# EAGLE schematic swarm (EAGLE 9.1.3)
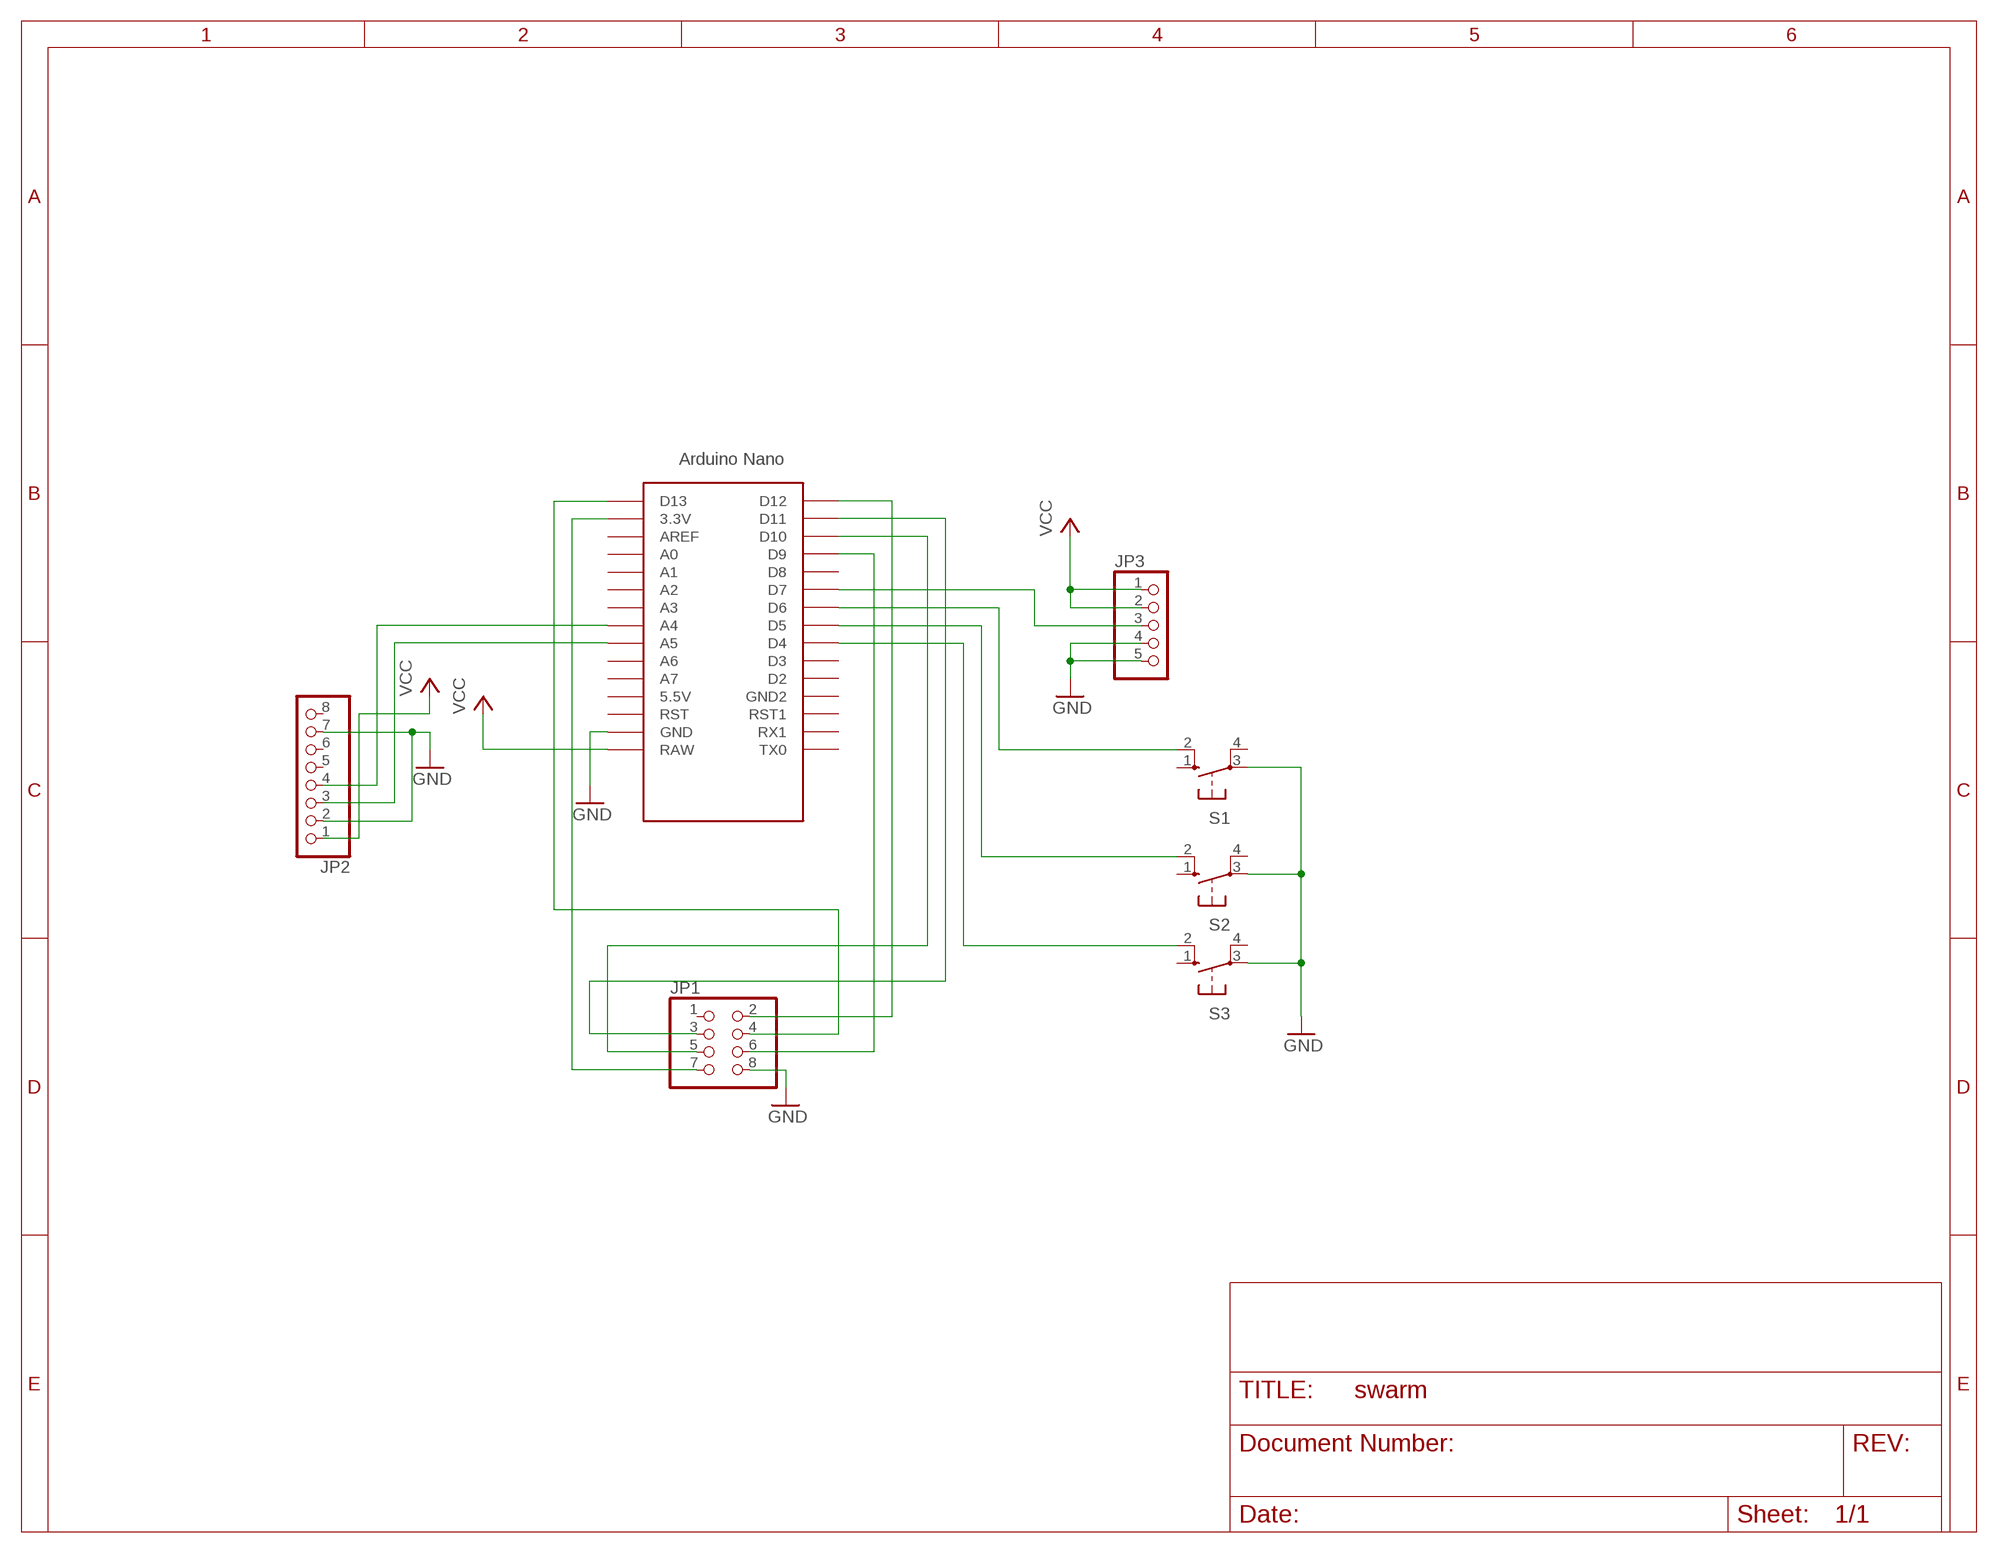
[diagram p0: schematic, sheet 1]

## Parts
JP1  PINHD-2X4  [2X04]
JP2  PINHD-1X8  [1X08]
JP3  PINHD-1X5  [1X05]
S1  10-XX  [B3F-10XX]
S2  10-XX  [B3F-10XX]
S3  10-XX  [B3F-10XX]
U$1  NANO  [NANO]

## Nets
GND: JP1.8 JP2.2 JP2.7 JP3.4 JP3.5 S1.3(P) S2.3(P) S3.3(P) U$1.GND
N$1: JP3.3 U$1.D7
N$2: JP2.3 U$1.A5
N$3: S1.2(S1) U$1.D6
N$4: JP2.4 U$1.A4
N$5: JP1.4 U$1.D13
N$6: JP1.6 U$1.D9
N$7: JP1.3 U$1.D11
N$8: JP1.5 U$1.D10
N$9: JP1.7 U$1.3.3V
N$10: S2.2(S1) U$1.D5
N$11: S3.2(S1) U$1.D4
N$12: JP1.2 U$1.D12
VCC: JP2.1 JP3.1 JP3.2 U$1.RAW
Unconnected: JP1.1 JP2.5 JP2.6 JP2.8 S1.1(S) S1.4(P1) S2.1(S) S2.4(P1) S3.1(S) S3.4(P1) U$1.5V(5.5V) U$1.A0 U$1.A1 U$1.A2 U$1.A3 U$1.A6 U$1.A7 U$1.AREF U$1.D2 U$1.D3 U$1.D8 U$1.GND1(GND2) U$1.ICSP1 U$1.ICSP2 U$1.ICSP3 U$1.ICSP4 U$1.ICSP5 U$1.ICSP6 U$1.RST U$1.RST1 U$1.RX1 U$1.TX0

## Library data of the parts
JP1 = pinhead:PINHD-2X4: PIN HEADER
JP2 = pinhead:PINHD-1X8: PIN HEADER
JP3 = pinhead:PINHD-1X5: PIN HEADER
S1-S3 = switch-omron:10-XX: OMRON SWITCH; MPN: B3F-1000; OC_FARNELL: 176432; OC_NEWARK: 36M3542
U$1 = Arduino-clone:NANO: Arduino Nano